# Altium schematic sheet (1) Controller A20_Power.SchDoc
size 304 x 228 mm; SheetNumber: 1; SheetTotal: 6
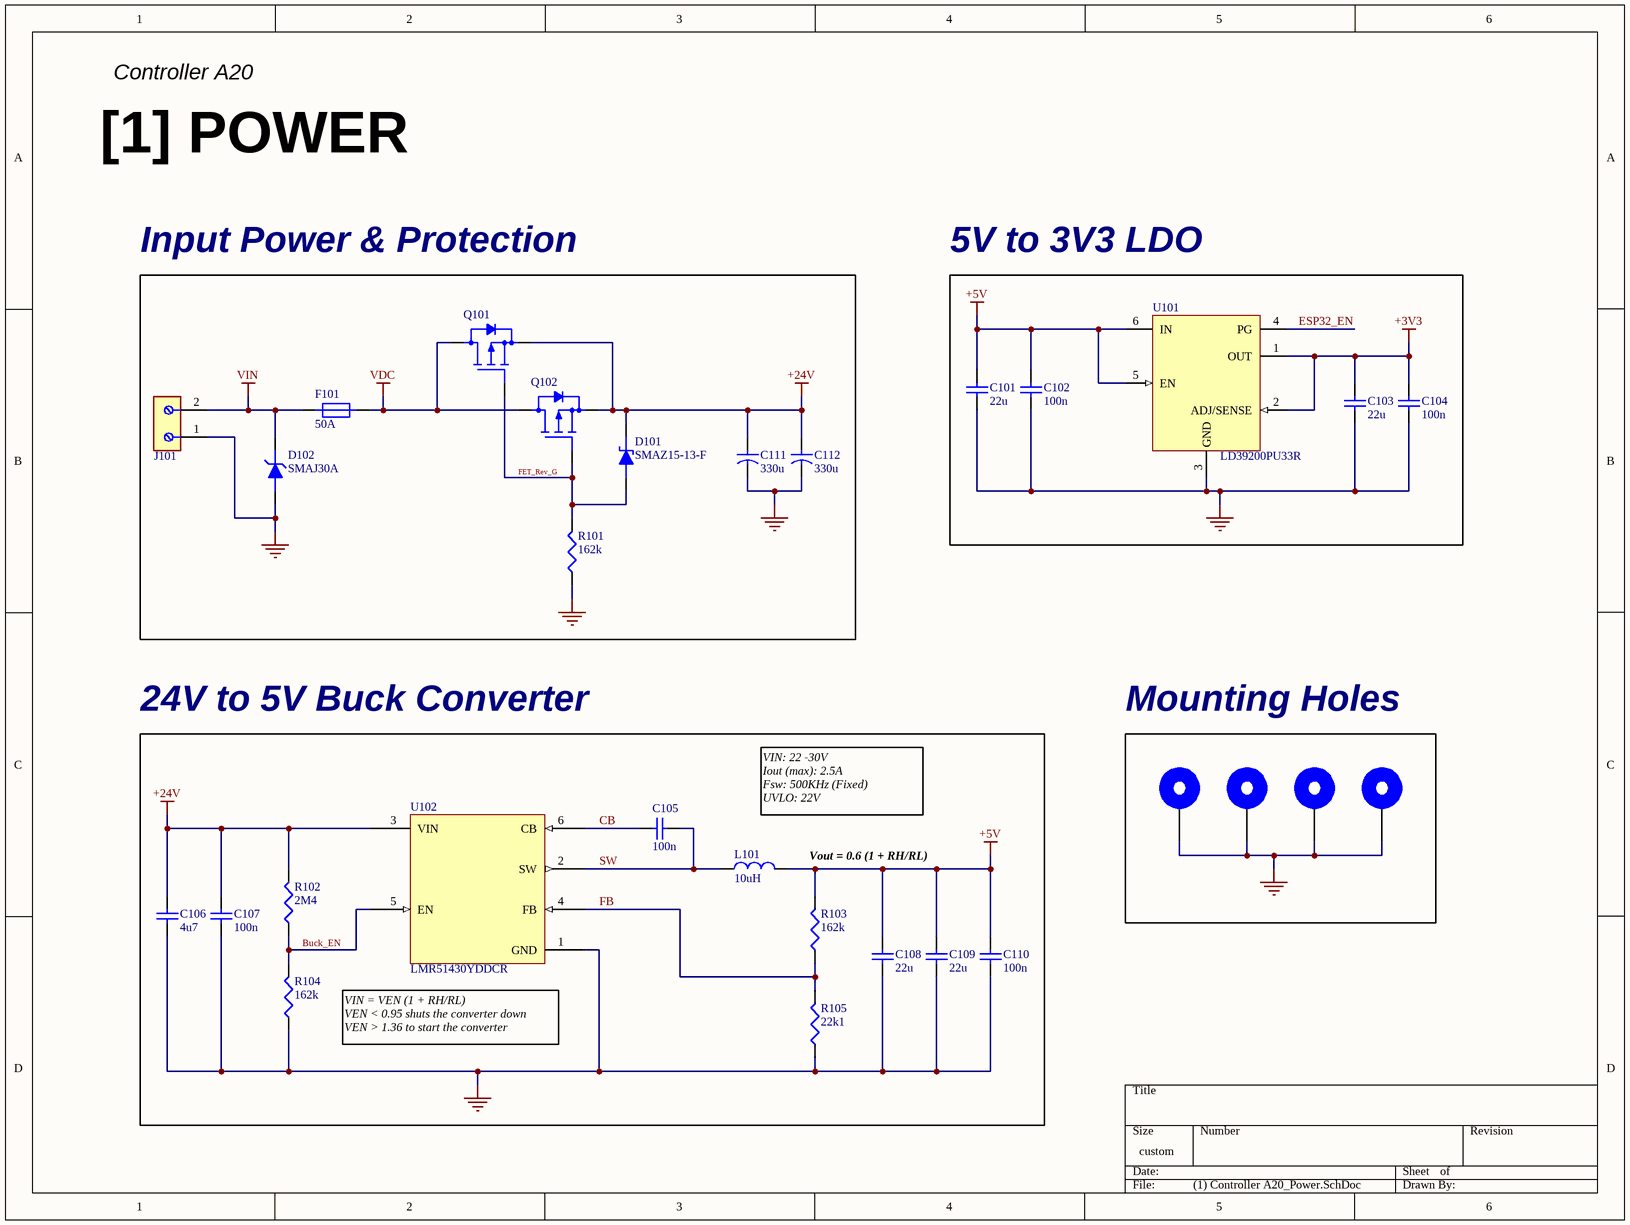
[diagram p0: (1) Controller A20_Power.SchDoc]

## Parts
C101  22u  [C0805]
C102  100n  [C0603]
C103  22u  [C0805]
C104  100n  [C0603]
C105  100n  [C0603]
C106  4u7  [C0805]
C107  100n  [C0603]
C108  22u  [C0805]
C109  22u  [C0805]
C110  100n  [C0603]
C111  330u  [SMD CAP,D10.3xL10.3mm]
C112  330u  [SMD CAP,D10.3xL10.3mm]
D101  SMAZ15-13-F  [DO-214AC(SMA)]
D102  SMAJ30A  [DO-214AC(SMA)]
F101  50A  [SMD Fuse,12.2 x 4.5 x 4.5 mm]
J101  691256610002  [10.16mm 2P STB]  (value not drawn)
J102  Mounting Hole D6mm H3mm  [MH D6mm H3mm]  (value not drawn)
J103  Mounting Hole D6mm H3mm  [MH D6mm H3mm]  (value not drawn)
J104  Mounting Hole D6mm H3mm  [MH D6mm H3mm]  (value not drawn)
J105  Mounting Hole D6mm H3mm  [MH D6mm H3mm]  (value not drawn)
L101  10uH  [L SMD 6.8x6.6]
Q101  XPH3R114MC,L1XHQ  [8-SOP Advance (5x5)]  (value not drawn)
Q102  XPH3R114MC,L1XHQ  [8-SOP Advance (5x5)]  (value not drawn)
R101  162k  [R0603]
R102  2M4  [R0603]
R103  162k  [R0603]
R104  162k  [R0603]
R105  22k1  [R0603]
U101  LD39200PU33R  [DFN-6(3x3)]
U102  LMR51430YDDCR  [SOT-23-6]

## Blocks framed on the sheet
Input Power & Protection: C111 C112 D101 D102 F101 J101 Q101 Q102 R101
5V to 3V3 LDO: C101-C104 U101
24V to 5V Buck Converter: C105-C110 L101 R102-R105 U102
Mounting Holes: J102-J105

## Nets
+3V3: C103.2 C104.2 U101.1(OUT) U101.2(ADJ/SENSE)
+5V: C101.2 C102.2 C108.2 C109.2 C110.2 L101.2 R103.2 U101.5(EN) U101.6(IN)
+24V: C106.2 C107.2 C111.1 C112.1 D101.2 Q101.1 Q102.1 R102.2 U102.3(VIN)
GND: C101.1 C102.1 C103.1 C104.1 C106.1 C107.1 C108.1 C109.1 C110.1 C111.2 C112.2 D102.1 J101.1 J102.1 J103.1 J104.1 J105.1 R101.1 R104.1 R105.1 U101.3(GND) U102.1(GND)
VDC: F101.1 Q101.5 Q102.5
VIN: D102.2 F101.2 J101.2
Buck_EN: R102.1 R104.2 U102.5(EN)
CB: C105.1 U102.6(CB)
ESP32_EN: U101.4(PG)
FB: R103.1 R105.2 U102.4(FB)
FET_Rev_G: D101.1 Q101.4 Q102.4 R101.2
SW: C105.2 L101.1 U102.2(SW)

## Notes on the sheet
- Controller A20
- [1] POWER
- VIN: 22 -30V
  Iout (max): 2.5A
  Fsw: 500KHz (Fixed)
  UVLO: 22V
- (near L101) Vout = 0.6 (1 + RH/RL)
- VIN = VEN (1 + RH/RL)
  VEN < 0.95 shuts the converter down
  VEN > 1.36 to start the converter

## Library data of the parts
C101 C103 C108 C109 = CAP 22uF 25V: 22 µF ±20% 25V Ceramic Capacitor X5R 0805 (2012 Metric); Manufacturer: Samsung Electro-Mechanics; Mfr. Part #: CL21A226MAYNNNE; Qty.: 10; Ext. Price: 0.43; Supplier: DigiKey; Supplier Part #: 1276-CL21A226MAYNNNECT-ND; Package: 0805; Unit Price: 0.043; ComponentLink1Description: Datasheet; ComponentLink1URL: https://mm.digikey.com/Volume0/opasdata/d220001/medias/docus/339/CL21A226MAYNNNE_Spec.pdf; ComponentLink2Description: Distributor Link; ComponentLink2URL: https://www.digikey.com/en/products/detail/samsung-electro-mechanics/CL21A226MAYNNNE/10479857
C102 C104 C105 C107 C110 = CAP 100nF 50V: 0.1 µF ±10% 50V Ceramic Capacitor X7R 0603 (1608 Metric); Manufacturer: KEMET; Mfr. Part #: C0603C104K5RACTU; Qty.: 10; Ext. Price: 0.11; Supplier: DigiKey; Supplier Part #: 399-C0603C104K5RACTUCT-ND; Package: 0603; Unit Price: 0.011; ComponentLink1Description: Datasheet; ComponentLink1URL: https://www.yageogroup.com/content/datasheet/asset/file/KEM_C1002_X7R_SMD; ComponentLink2Description: Distributor Link; ComponentLink2URL: https://www.digikey.com/en/products/detail/kemet/C0603C104K5RACTU/1465594
C106 = CAP 4.7uF 50V: 4.7 µF ±20% 50V Ceramic Capacitor X7R 0805 (2012 Metric); Manufacturer: Murata Electronics; Mfr. Part #: GRM21BZ71H475ME15K; Qty.: 1; Ext. Price: 0.27; Supplier: DigiKey; Supplier Part #: 490-GRM21BZ71H475ME15KCT-ND; Package: 0805; Unit Price: 0.27; ComponentLink1Description: Datasheet; ComponentLink1URL: https://search.murata.co.jp/Ceramy/image/img/A01X/G101/ENG/GRM21BZ71H475ME15-01.pdf; ComponentLink2Description: Distributor Link; ComponentLink2URL: https://www.digikey.com/en/products/detail/murata-electronics/GRM21BZ71H475ME15K/13904866
C111 C112 = Electrolytic CAP 330uF 50V: 330 µF 50 V Aluminum Electrolytic Capacitors Radial, Can - SMD 2000 Hrs @ 105°C; Manufacturer: Nichicon; Mfr. Part #: UCM1H331MNL1GS; Qty.: 1; Ext. Price: 1.18; Supplier: DigiKey; Supplier Part #: 493-14535-1-ND; Package: SMD,D10.3xL10.3mm; Unit Price: 1.18; ComponentLink1Description: Datasheet; ComponentLink1URL: https://www.nichicon.co.jp/english/series_items/catalog_pdf/e-ucm.pdf; ComponentLink2Description: Distributor Link; ComponentLink2URL: https://www.digikey.com/en/products/detail/nichicon/UCM1H331MNL1GS/4991858
D101 = SMAZ15-13-F 15V Zener Diode: Zener Diode 15 V 1 W ±5% Surface Mount SMA; Manufacturer: Diodes Incorporated; Qty.: 1; Ext. Price: 0.28; Mfr. Part #: SMAZ15-13-F; Supplier: DigiKey; Supplier Part #: SMAZ15-FDICT-ND; Package: DO-214AC(SMA); Unit Price: 0.28; ComponentLink1Description: Datasheet; ComponentLink1URL: https://www.diodes.com/assets/Datasheets/ds18015.pdf; ComponentLink2Description: Distributor Link; ComponentLink2URL: https://www.digikey.com/en/products/detail/diodes-incorporated/SMAZ15-13-F/775753
D102 = SMAJ30A TVS Diode 30VRWM: 48.4V Clamp 8.3A Ipp Tvs Diode Surface Mount DO-214AC; Manufacturer: Würth Elektronik; Qty.: 1; Ext. Price: 0.29; Mfr. Part #: SMAJ30A; Supplier: DigiKey; Supplier Part #: 732-SMAJ30ACT-ND; Package: DO-214AC(SMA); Unit Price: 0.29; ComponentLink1Description: Datasheet; ComponentLink1URL: https://www.we-online.com/components/products/datasheet/824500301.pdf; ComponentLink2Description: Distributor Link; ComponentLink2URL: https://www.digikey.com/en/products/detail/w%C3%BCrth-elektronik/SMAJ30A/5870799
F101 = 0456050.DRSDE Fuse 50A: 50 A 250 V 80 V Fuse Board Mount (Cartridge Style Excluded) Surface Mount 2-SMD, Square End Block; Manufacturer: Littelfuse Inc.; Qty.: 1; Ext. Price: 6.13; Mfr. Part #: 0456050.DRSDE; Supplier: DigiKey; Supplier Part #: 18-0456050.DRSDECT-ND; Package: SMD,12.2 x 4.5 x 4.5 mm; Unit Price: 6.13; ComponentLink1Description: Datasheet; ComponentLink1URL: https://www.littelfuse.com/assetdocs/littelfuse-nano2-fuse-456sde-series-datasheet?assetguid=a4746110-f339-4e5a-85ce-ce23fbd88349; ComponentLink2Description: Distributor Link; ComponentLink2URL: https://www.digikey.com/en/products/detail/littelfuse-inc/0456050-DRSDE/14005839
J101 = Terminal Block 2P 57A: 2 Position Wire to Board Terminal Block Horizontal with Board 0.400" (10.16mm) Through Hole; Manufacturer: Würth Elektronik; Qty.: 1; Ext. Price: 3.36; Mfr. Part #: 691256610002; Supplier: DigiKey; Supplier Part #: 732-11031-ND; Package: Through Hole, P=10.16mm; Unit Price: 3.36; ComponentLink1Description: Datasheet; ComponentLink1URL: https://www.we-online.com/components/products/datasheet/691256610002.pdf; ComponentLink2Description: Distributor Link; ComponentLink2URL: https://www.digikey.com/en/products/detail/w%C3%BCrth-elektronik/691256610002/6644127
L101 = 10uH 7A Inductor: 10 µH Shielded Inductor 7 A 29.82mOhm Max Nonstandard; Manufacturer: Pulse Electronics; Mfr. Part #: PM5432.103NLT; Qty.: 1; Ext. Price: 1.83; Supplier: DigiKey; Supplier Part #: 553-PM5432.103NLTCT-ND; Package: SMD, 6.8x6.6; Unit Price: 1.83; ComponentLink1Description: Datasheet; ComponentLink1URL: https://www.yageogroup.com/content/datasheet/asset/file/DATASHEET_P890; ComponentLink2Description: Distributor Link; ComponentLink2URL: https://www.digikey.com/en/products/detail/pulse-electronics/PM5432-103NLT/13693950
Q101 Q102 = MOSFET P-CH 40V 100A: P-Channel 40 V 100A (Ta) 960mW (Ta), 170W (Tc) Surface Mount 8-SOP Advance (5x5); Manufacturer: Toshiba Semiconductor and Storage; Qty.: 1; Ext. Price: 1.82; Mfr. Part #: XPH3R114MC,L1XHQ; Supplier: DigiKey; Supplier Part #: 264-XPH3R114MCL1XHQCT-ND; Package: 8-SOP Advance (5x5); Unit Price: 1.82; ComponentLink1Description: Datasheet; ComponentLink1URL: https://toshiba.semicon-storage.com/info/XPH3R114MC_datasheet_en_20241216.pdf?did=63639&prodName=XPH3R114MC; ComponentLink2Description: Distributor Link; ComponentLink2URL: https://www.digikey.com/en/products/detail/toshiba-semiconductor-and-storage/XPH3R114MC-L1XHQ/12155003
R101 R103 R104 = RES 162k: 162 kOhms ±1% 0.1W, 1/10W Chip Resistor 0603 (1608 Metric) Moisture Resistant Thick Film; Manufacturer: YAGEO; Mfr. Part #: RC0603FR-07162KL; Qty.: 10; Ext. Price: 0.06; Supplier: DigiKey; Supplier Part #: 311-162KHRCT-ND; Package: 0603; Unit Price: 0.006; ComponentLink1Description: Datasheet; ComponentLink1URL: https://www.yageogroup.com/content/datasheet/asset/file/PYU-RT_1-TO-0-01_ROHS_L; ComponentLink2Description: Distributor Link; ComponentLink2URL: https://www.digikey.com/en/products/detail/yageo/RC0603FR-07162KL/726975
R102 = RES 2.4M: 2.4 MOhms ±1% 0.1W, 1/10W Chip Resistor 0603 (1608 Metric) Moisture Resistant Thick Film; Manufacturer: YAGEO; Mfr. Part #: RC0603FR-072M4L; Qty.: 10; Ext. Price: 0.11; Supplier: DigiKey; Supplier Part #: 13-RC0603FR-072M4LCT-ND; Package: 0603; Unit Price: 0.011; ComponentLink1Description: Datasheet; ComponentLink1URL: https://www.yageogroup.com/content/datasheet/asset/file/PYU-RT_1-TO-0-01_ROHS_L; ComponentLink2Description: Distributor Link; ComponentLink2URL: https://www.digikey.com/en/products/detail/yageo/RC0603FR-072M4L/5918310
R105 = RES 22.1k: 22.1 kOhms ±1% 0.1W, 1/10W Chip Resistor 0603 (1608 Metric) Thin Film; Manufacturer: YAGEO; Mfr. Part #: RT0603FRE0722K1L; Qty.: 10; Ext. Price: 0.14; Supplier: DigiKey; Supplier Part #: 13-RT0603FRE0722K1LCT-ND; Package: 0603; Unit Price: 0.014; ComponentLink1Description: Datasheet; ComponentLink1URL: https://www.yageogroup.com/content/datasheet/asset/file/PYU-RT_1-TO-0-01_ROHS_L; ComponentLink2Description: Distributor Link; ComponentLink2URL: https://www.digikey.com/en/products/detail/yageo/RT0603FRE0722K1L/1075211
U101 = LDO 3V3 2A: Linear Voltage Regulator IC Positive Fixed 1 Output 2A 6-DFN (3x3); Manufacturer: STMicroelectronics; Qty.: 1; Ext. Price: 1.05; Mfr. Part #: LD39200PU33R; Supplier: DigiKey; Supplier Part #: 497-15229-1-ND; Package: DFN-6(3x3); Unit Price: 1.05; ComponentLink1Description: Datasheet; ComponentLink1URL: https://www.st.com/content/ccc/resource/technical/document/datasheet/4b/e6/2e/a4/16/04/46/9d/DM00102135.pdf/files/DM00102135.pdf/jcr:content/translations/en.DM00102135.pdf; ComponentLink2Description: Distributor Link; ComponentLink2URL: https://www.digikey.com/en/products/detail/stmicroelectronics/LD39200PU33R/5131797
U102 = LMR51430YDDCR Buck Converter: Buck Switching Regulator IC Positive Adjustable 0.6V 1 Output 3A SOT-23-6 Thin, TSOT-23-6; Manufacturer: Texas Instruments; Qty.: 1; Ext. Price: 1.58; Mfr. Part #: LMR51430YDDCR; Supplier: DigiKey; Supplier Part #: 296-LMR51430YDDCRCT-ND; Package: TSOT-23-6; Unit Price: 1.58; ComponentLink1Description: Datasheet; ComponentLink1URL: https://www.ti.com/lit/ds/symlink/lmr51430.pdf; ComponentLink2Description: Distributor Link; ComponentLink2URL: https://www.digikey.com/en/products/detail/texas-instruments/LMR51430YDDCR/17878361?s=N4IgTCBcDaIDIFkBKBWAjAFgMwAYCaAIgQMJIgC6AvkA